# EAGLE design Adafruit Feather 32u4 Adalogger (EAGLE 6.4)
COMPANY: ADAFRUIT INDUSTRIES; DRAWN: KTOWN; REV: B
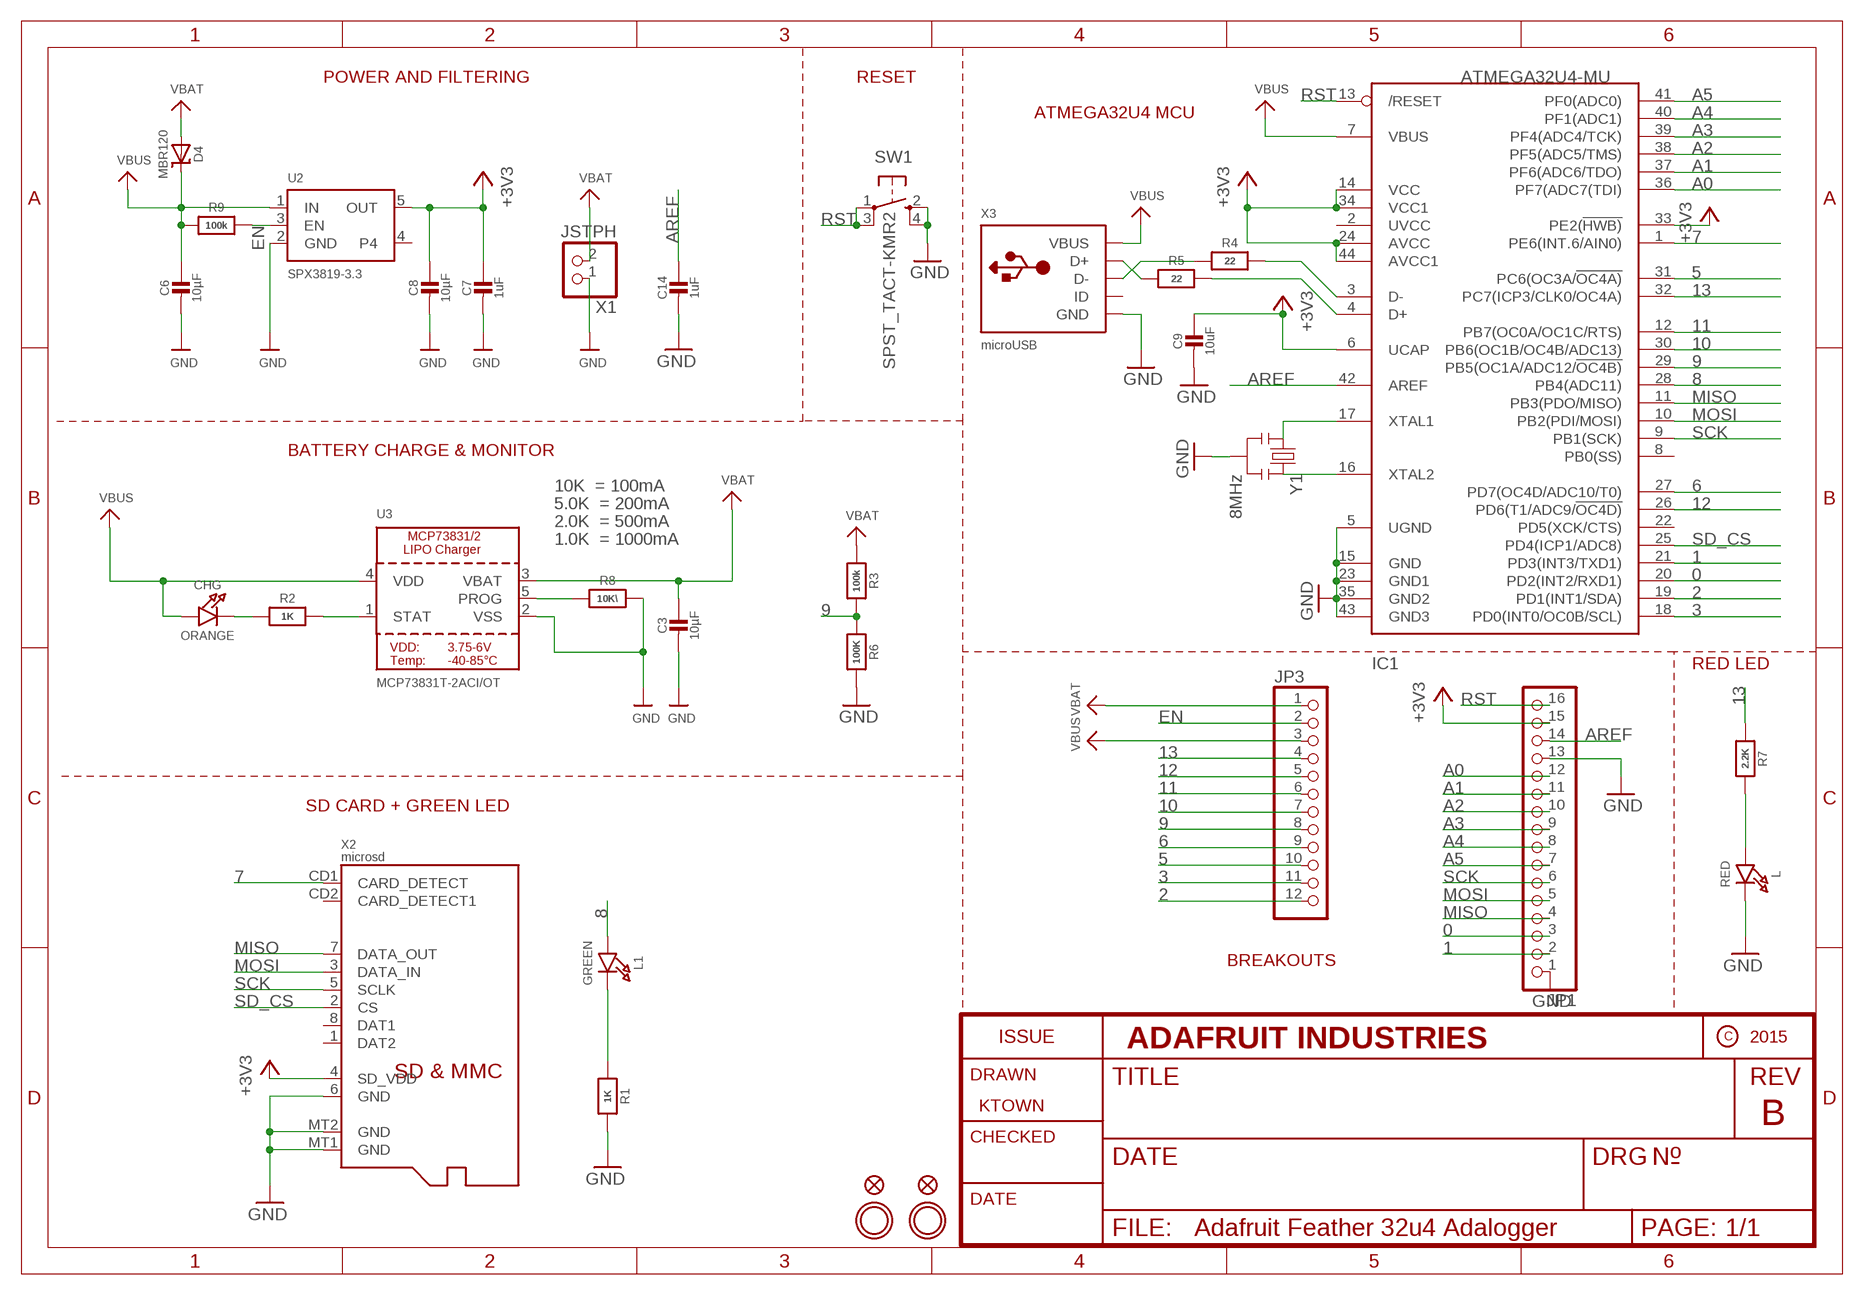
[diagram p0: schematic, sheet 1]

## Parts
C3  10µF  CAP_CERAMIC0805-NOOUTLINE  [0805-NO]
C6  10µF  CAP_CERAMIC0805-NOOUTLINE  [0805-NO]
C7  1uF  CAP_CERAMIC0603_NO  [0603-NO]
C8  10µF  CAP_CERAMIC0805-NOOUTLINE  [0805-NO]
C9  10uF  CAP_CERAMIC0805-NOOUTLINE  [0805-NO]
C14  1uF  CAP_CERAMIC0603_NO  [0603-NO]
CHG  ORANGE  LED0805_NOOUTLINE  [CHIPLED_0805_NOOUTLINE]
D4  MBR120  DIODE-SCHOTTKYSOD-123  [SOD-123]
IC1  ATMEGA32U4-MU  [TQFN44_7MM]
JP1  HEADER-1X16ROUND  [1X16_ROUND]
JP3  HEADER-1X12  [1X12_ROUND]
L  RED  LED0805_NOOUTLINE  [CHIPLED_0805_NOOUTLINE]
L1  GREEN  LED0805_NOOUTLINE  [CHIPLED_0805_NOOUTLINE]
R1  1K  RESISTOR_0603_NOOUT  [0603-NO]
R2  1K  RESISTOR_0603_NOOUT  [0603-NO]
R3  100k  RESISTOR_0603_NOOUT  [0603-NO]
R4  22  RESISTOR_0603_NOOUT  [0603-NO]
R5  22  RESISTOR_0603_NOOUT  [0603-NO]
R6  100K  RESISTOR_0603MP  [_0603MP]
R7  2.2K  RESISTOR_0603_NOOUT  [0603-NO]
R8  10K\  RESISTOR_0603_NOOUT  [0603-NO]
R9  100k  RESISTOR_0603_NOOUT  [0603-NO]
SW1  SPST_TACT-KMR2  [KMR2]
U2  SPX3819-3.3  VREG_SOT23-5  [SOT23-5]
U3  MCP73831T-2ACI/OT  MCP73831/2  [SOT23-5]
U$31  MOUNTINGHOLE2.5  [MOUNTINGHOLE_2.5_PLATED]
U$32  MOUNTINGHOLE2.5  [MOUNTINGHOLE_2.5_PLATED]
U$34  FIDUCIAL""  [FIDUCIAL_1MM]
U$35  FIDUCIAL""  [FIDUCIAL_1MM]
X1  JSTPH  CON_JST_PH_2PIN  [JSTPH2]
X2  microsd  MICROSD  [MICROSD]
X3  microUSB  USB_MICRO_20329_V2  [4UCONN_20329_V2]
Y1  8MHz  RESONATORSMD  [RESONATOR-SMD]

## Nets
0: IC1.20(PD2(INT2/RXD1)) JP1.3
1: IC1.21(PD3(INT3/TXD1)) JP1.2
2: IC1.19(PD1(INT1/SDA)) JP3.12
3: IC1.18(PD0(INT0/OC0B/SCL)) JP3.11
5: IC1.31(PC6(OC3A/!OC4A)) JP3.10
6: IC1.27(PD7(OC4D/ADC10/T0)) JP3.9
7: IC1.1(PE6(INT.6/AIN0)) X2.CD1(CARD_DETECT)
8: IC1.28(PB4(ADC11)) L1.A
9: IC1.29(PB5(OC1A/ADC12/!OC4B)) JP3.8 R3.2 R6.1
10: IC1.30(PB6(OC1B/OC4B/ADC13)) JP3.7
11: IC1.12(PB7(OC0A/OC1C/RTS)) JP3.6
12: IC1.26(PD6(T1/ADC9/!OC4D)) JP3.5
13: IC1.32(PC7(ICP3/CLK0/OC4A)) JP3.4 R7.1
+3V3: C7.1 C8.1 C9.1 IC1.6(UCAP) IC1.14(VCC) IC1.24(AVCC) IC1.33(PE2(!HWB)) IC1.34(VCC1) IC1.44(AVCC1) JP1.15 U2.5(OUT) X2.4(SD_VDD)
A0: IC1.36(PF7(ADC7(TDI)) JP1.12
A1: IC1.37(PF6(ADC6/TDO)) JP1.11
A2: IC1.38(PF5(ADC5/TMS)) JP1.10
A3: IC1.39(PF4(ADC4/TCK)) JP1.9
A4: IC1.40(PF1(ADC1)) JP1.8
A5: IC1.41(PF0(ADC0)) JP1.7
AREF: C14.1 IC1.42(AREF) JP1.14
D+: IC1.4(D+) R5.2
D-: IC1.3(D-) R4.2
EN: JP3.2 R9.2 U2.3(EN)
GND: C3.2 C6.2 C7.2 C8.2 C9.2 C14.2 IC1.5(UGND) IC1.15(GND) IC1.23(GND1) IC1.35(GND2) IC1.43(GND3) JP1.1 JP1.13 L.C R1.2 R6.2 R8.2 SW1.2(S) SW1.4(S1) U2.2(GND) U3.2(VSS) X1.1 X2.6(GND) X2.MT1(GND) X2.MT2(GND) X3.BASE@1(GND) X3.BASE@2(GND) X3.GND X3.SPRT@1(GND) X3.SPRT@2(GND) X3.SPRT@3(GND) X3.SPRT@4(GND) Y1.2
MISO: IC1.11(PB3(PDO/MISO)) JP1.4 X2.7(DATA_OUT)
MOSI: IC1.10(PB2(PDI/MOSI)) JP1.5 X2.3(DATA_IN)
N$1: CHG.C R2.1
N$2: L.A R7.2
N$3: R2.2 U3.1(STAT)
N$4: R8.1 U3.5(PROG)
N$5: L1.C R1.1
N$11: IC1.16(XTAL2) Y1.3
N$12: IC1.17(XTAL1) Y1.1
N$15: R5.1 X3.D+
N$16: R4.1 X3.D-
RST: IC1.13(/RESET) JP1.16 SW1.1(P) SW1.3(P1)
SCK: IC1.9(PB1(SCK)) JP1.6 X2.5(SCLK)
SD_CS: IC1.25(PD4(ICP1/ADC8)) X2.2(CS)
VBAT: C3.1 D4.A JP3.1 R3.1 U3.3(VBAT) X1.2
VBUS: C6.1 CHG.A D4.C IC1.7(VBUS) JP3.3 R9.1 U2.1(IN) U3.4(VDD) X3.VBUS
Unconnected: IC1.2(UVCC) IC1.8(PB0(SS)) IC1.22(PD5(XCK/CTS)) U2.4 X2.1(DAT2) X2.8(DAT1) X2.CD2(CARD_DETECT1) X3.ID

## Notes on the sheet
- POWER AND FILTERING | RESET
- ATMEGA32U4 MCU
- BATTERY CHARGE & MONITOR
- 10K  = 100mA
- 5.0K  = 200mA
- 2.0K  = 500mA
- 1.0K  = 1000mA
- RED LED
- SD CARD + GREEN LED
- BREAKOUTS

## Library data of the parts
C3 C6-C9 C14 = microbuilder:CAP_CERAMIC: Ceramic Capacitors For new designs, use the packages preceded by an '_' character since they are more reliable: The following footprints should be used on most boards: _0402 - Standard footprint for regular board layouts _0603 - Standard footprint for regular board layouts _0805 - Standard footprint for regular board layouts _1206 - Standard footprint for regular board layouts For extremely tight-pitch boards where space is at a premium, the following 'micro-pitch' footprints can be used (smaller pads, no silkscreen outline, etc.): _0402MP - Micro-pitch footprint for very dense/compact boards _0603MP - Micro-pitch footprint for very dense/compact boards _0805MP - Micro-pitch footprint for very dense/compact boards _1206MP - Micro-pitch footprint for very dense/compact boards
CHG L L1 = microbuilder:LED: LED 0603 - 0603 Surface Mount Package 2mA: Green LED - Low Power (3.9mcd, 2ma, 1.7Vf) - Digikey: 475-2709-2-ND Orange LED - Low Power (9.8mcd, 2ma, 1.8Vf) - Digikey: 475-1194-2-ND Red LED - Low Power (5mcd, 2ma, 1.8Vf) - Digikey: 475-1195-2-ND Yellow LED - Low Power (7mcd, 2ma, 1.8Vf) - Digikey: 475-1196-2-ND 5mA: Blue LED - Low Power (17mcd, 5ma, 2.9Vf) - Digikey: LNJ937W8CRACT-ND 0805 - 0805 Surface Mount Package 2mA: Red LED (8.8mcd, 2mA, 1.8Vf, Clear) - Low Power [Digikey: 475-2510-1-ND] Green LED (5mcd, 2mA, 1.8Vf, Clear) - Low Power [Digikey: 475-2730-1-ND] Yellow LED (11.3mcd, 2mA, 1.8Vf, Clear) - Low Power [Digikey: 475-2555-1-ND] 20mA: Red LED (104mcd, 20mA, Diffused) - LS R976 [Digikey: 475-1278-6-ND] Red LED (12mcd, 20mA, 2.0Vf, Clear) - APT2012EC [Digikey: 754-1128-1-ND] Green LED (15mcd, 20mA, 2.2Vf, Clear) - APT2012GC [Digikey: 754-1131-1-ND] Orange LED (160mcd, 20mA, 2.1Vf, Clear) - APT2012SECK [Digikey: 754-1130-1-ND] 1206 - 1206 Surface Mount Package Green LED (26mcd, 20mA, Diffused) - LG N971 [Digikey: 475-1407-6-ND] Red LED (15mcd, 20mA, Diffused) - LH N974 [Digikey: 475-1416-6-ND] Cree - Cree High-Power Surface Mount LEDs XPEBWT-L1-0000-00D50 - White 111lm 350mA 2.9Vf 6200K 110° XTEAWT-00-0000-00000LEE3 - White 114lm 350mA 2.85Vf 5000K 115° Everlight - Everlight 45-21 Series Surface Mount LEDs 45-21/QK2C-B2832AC2CB2/2T - Warm White 2000mcd 20mA 3.25Vf 3050K 120° 45-21/LK2C-B38452C4CB2/2T - Nuetral White 2000mcd 20mA 3.25Vf 4150K 120° 45-21/LK2C-B50634C6CB2/2T - Cold White 2200mcd 20mA 3.25Vf 5650K 120° PLCC2 Reverse Mount LS T77K-J1L2-1-0-2-R18-Z - Red 11.25mcd 2mA 1.8Vf 630nm 120° LO T77K-L1M2-24-Z - Orange 19.6mcd 2mA 1.8Vf 606nm 120° LY T77K-K2M1-26-Z - Yellow 15.7mcd 2mA 1.8Vf 587nm 120°
D4 = microbuilder:DIODE-SCHOTTKY
IC1 = microbuilder:ATMEGA32U4: http://www.ladyada.net/library/eagle
JP1 = microbuilder:HEADER-1X16: PIN HEADER
JP3 = microbuilder:HEADER-1X12
R1-R9 = microbuilder:RESISTOR: Resistors For new designs, use the packages preceded by an '_' character since they are more reliable: The following footprints should be used on most boards: _0402 - Standard footprint for regular board layouts _0603 - Standard footprint for regular board layouts _0805 - Standard footprint for regular board layouts _1206 - Standard footprint for regular board layouts For extremely tight-pitch boards where space is at a premium, the following 'micro-pitch' footprints can be used (smaller pads, no silkscreen outline, etc.): _0402MP - Micro-pitch footprint for very dense/compact boards _0603MP - Micro-pitch footprint for very dense/compact boards _0805MP - Micro-pitch footprint for very dense/compact boards _1206MP - Micro-pitch footprint for very dense/compact boards
SW1 = adafruit:SPST_TACT: SMT 6mm switch, EVQQ2 series http://www.ladyada.net/library/eagle
U2 = microbuilder:VREG_SOT23-5: SOT23-5 Fixed Voltage Regulators Part Current Out V Out V In V Dropout θJA (°C/W) TJ (°C) Digikey Part No. ADP121 150mA 3.3V 3.4-5.5V 0.09V @ 150mA -- -- ADP121-AUJZ33R7CT-ND ADP121 150mA 3.0V 3.1-5.5V 0.09V @ 150mA -- -- ADP121-AUJZ30R7CT-ND ADP122 300mA 3.3V 3.4-5.5V 0.085V @ 300mA -- -- ADP122AUJZ-3.3-R7CT-ND ADP1712 300mA 3.3V 3.5-5.5V 0.17V @ 300mA -- -- ADP1712AUJZ-3.3-R7TR-ND AP7311 (Low Cost) 150mA 3.3V 3.5-6V 0.15V @ 150mA -- -- AP7311-33WG-7DICT-ND LD39015M18R 150mA 1.8V 1.9V-5.5V 0.08V @ 100mA -- -- 497-6977-1-ND LP2985A-33DBVR 150mA 3.3V 3.3-16V 0.28V @ 150mA 206 150 296-18479-1-ND MCP1824T-3302E/OT 300mA 3.3V 3.5V-6V 0.2V @ 300mA -- -- MCP1824T-3302E/OTCT-ND MIC5205-2.5YM5 TR 150mA 2.5V 2.7-16V 0.165V @ 150mA -- -- 576-1257-2-ND MIC5205-3.0YM5 TR 150mA 3.0V 3.2V-16V 0.165V @ 150mA -- -- 576-1258-2-ND MIC5205-3.3YM5 TR 150mA 3.3V 3.5V-16V 0.165V @ 150mA -- -- 576-1259-2-ND TPS780330220 150mA 3.3V+2.2V 3.6-5.5V 250mV Max -- -- 296-23332-1-ND TDA3663/N1,135 100mA 3.3V 3.5-45V 0.18V @ 50mA -- -- 568-5343-1-ND Max operating temp can be calculated using θJA, TJ (max junction temperature), and power in watts. Set the "Maximum Ambient Temperature" until it reaches TJ ("Max Junction Temperature"), which is the absolute limit for safe use of the regulator: Heat Sink Temperature Calculator <http://www.daycounter.com/Calculators/Heat-Sink-Temperature-Calculator.phtml> For example, With 12V source into a 3.3V LP2985 and a 30mA load, we are dissipating (12V-3.3V) * 0.03A = 0.261W. With a θJA of 206 °C/W, a TJ of 150°C, and 261mW we can safely use the chip without a heat sink up to 75°C (=147.1°C Junction Temperature).
U3 = microbuilder:MCP73831/2: MCP73831/2 LIPO Charger VDD: 3.75 - 6V Temp -40 - 85°C Programmable Charge Rate: 15-500mA NOTE: STAT is a tri-state logic output on the MCP73831 and an open-drain output on the MCP73832. SOT23-5 with 4.2V output and tri-state logic on STAT = MCP73831T-2ACI/OT
U$31 U$32 = microbuilder:MOUNTINGHOLE: Mounting Hole For #2 screws (0.086"/2.18mm width, 0.094"/2.4mm hole) use 2.5mm; BOM: EXCLUDE
U$34 U$35 = microbuilder:FIDUCIAL: Fiducial Alignment Points Various fiducial points for machine vision alignment.; BOM: EXCLUDE
X1 = microbuilder:CON_JST_PH_2PIN: JST 2-Pin Right-Angle Connector PH-Series - 4UConnector: 17311 SH-Series - 4UConnector: 07278
X2 = microbuilder:MICROSD: MicroSD/Transflash Card Holder with SPI pinout 3M: 2908-05WB-MG 4UConnector: 19656 Footprint courtesy: Adafruit Industries
X3 = microbuilder:USB: USB Connectors USBMINIB - Surface Mount Female Mini-B USB Connector 4UConnector: 06564
Y1 = SparkFun:RESONATOR: Resonator Small SMD resonator. This is the itty bitty 10/20MHz resonators with built in caps. CSTCE10M0G55 and CSTCE20M0V53. Footprint has been reviewed closely but hasn't been tested yet.

## Board
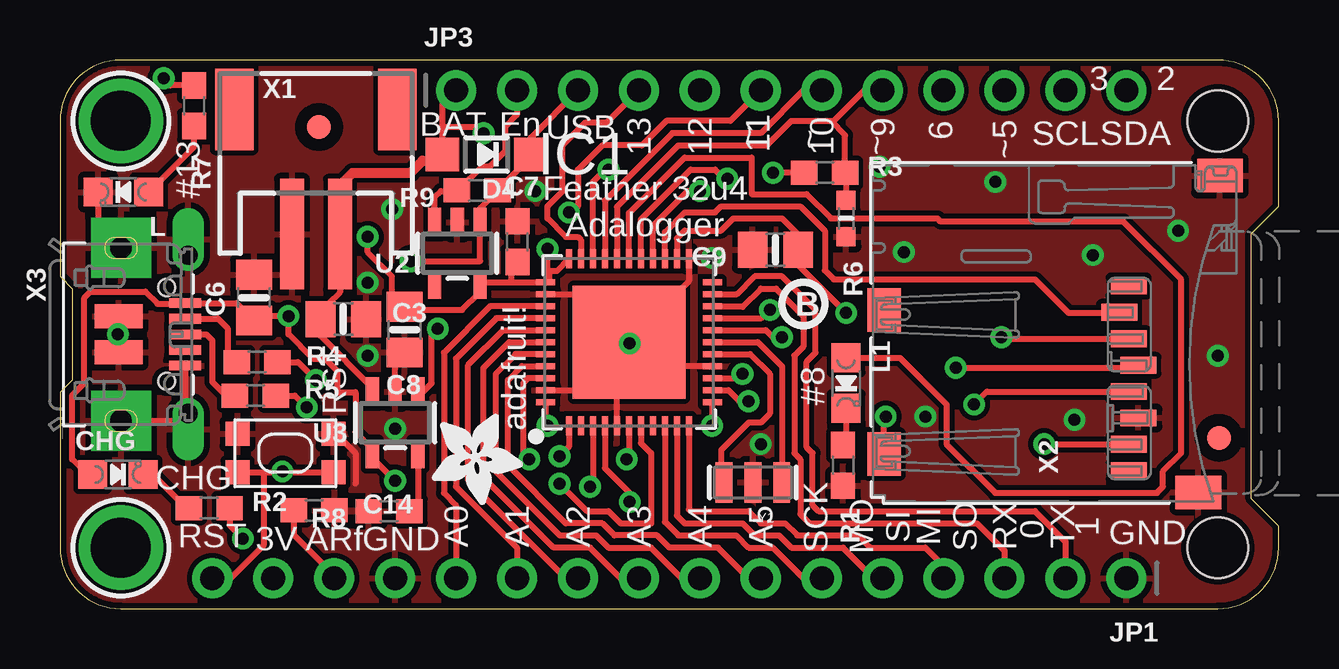
[diagram p1: board, top side]
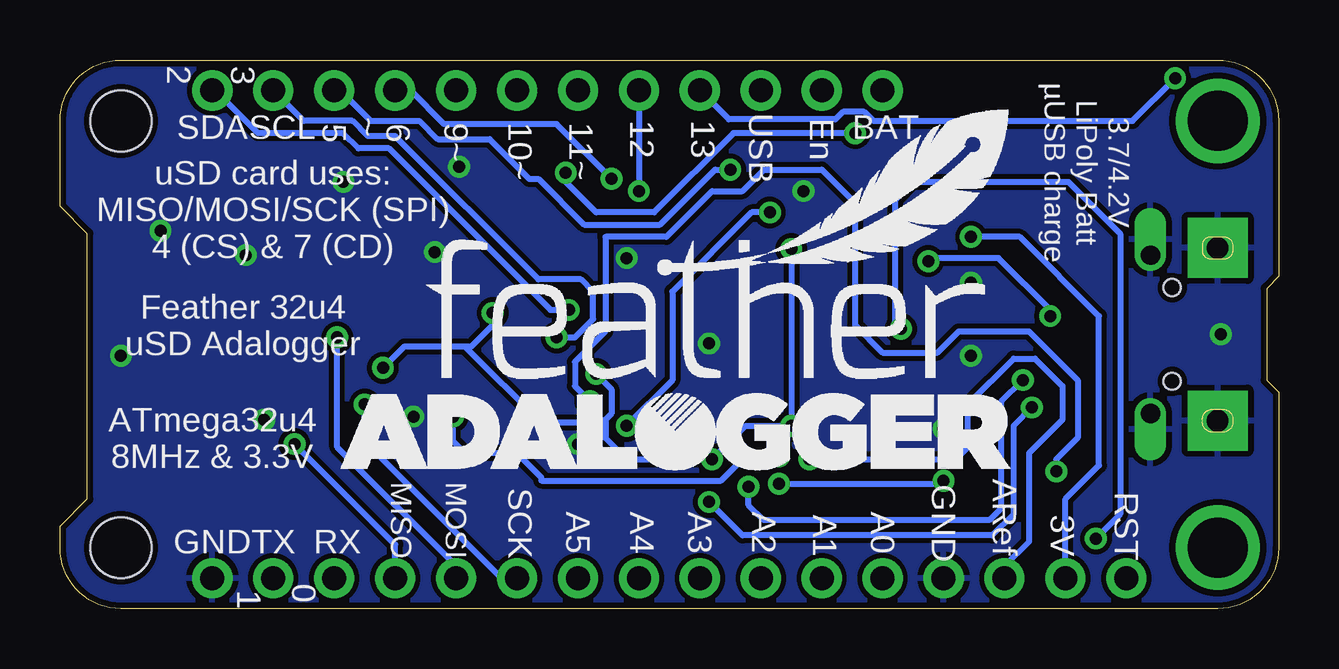
[diagram p2: board, bottom side, seen from below]

Size 50.8 x 22.86 mm. Coordinates in mm from the lower left corner, seen from the top.
Outline: 2.54,0 48.26,0 arc90 50.8,2.54 50.8,3.43 49.66,4.57 49.66,15.62 50.8,16.76 50.8,20.32 arc90 48.26,22.86 2.54,22.86 arc90 0,20.32 0,13.84 0.51,13.34 0.51,9.53 0,9.02 0,2.54 arc90 2.54,0
Copper layers (1*16): Top 0.035mm / dielectric 1.5mm / Bottom 0.035mm
Design rules "adafruit *": minimum track width 8mil, minimum drill 15.5mil, track to track 8mil, track to pad 8mil, pad to pad 8mil, via to via 8mil, smd to smd 8mil, copper to edge 10mil, drill to drill 8mil, minimum pad ring 10mil, minimum via ring 8mil, stop-mask expansion 2mil, vias tented up to drill 20mil, thermal gap 10mil
Holes 2.54 mm at 48.26,20.32 48.26,2.54

### Footprints (pad centres in the part's own frame; a part is rotated, then mirrored left to right if it is on the bottom)
0805-NO = smd 1.24 x 1.5: 1 -0.95,0; 2 0.95,0
0603-NO = smd 1.1 x 1: 1 -0.85,0; 2 0.85,0
CHIPLED_0805_NOOUTLINE = smd 1.2 x 1.2: A 0,-1.05; C 0,1.05
SOD-123 = smd 1.4 x 1.4: A 1.85,0; C -1.85,0
TQFN44_7MM = smd 0.25 x 0.8: 1 -2.5,-3.475; 2 -2,-3.475; 3 -1.5,-3.475; 4 -1,-3.475; 5 -0.5,-3.475; 6 0,-3.475; 7 0.5,-3.475; 8 1,-3.475; 9 1.5,-3.475; 10 2,-3.475; 11 2.5,-3.475; 23 2.5,3.475; 24 2,3.475; 25 1.5,3.475; 26 1,3.475; 27 0.5,3.475; 28 0,3.475; 29 -0.5,3.475; 30 -1,3.475; 31 -1.5,3.475; 32 -2,3.475; 33 -2.5,3.475 | smd 0.8 x 0.25: 12 3.475,-2.5; 13 3.475,-2; 14 3.475,-1.5; 15 3.475,-1; 16 3.475,-0.5; 17 3.475,0; 18 3.475,0.5; 19 3.475,1; 20 3.475,1.5; 21 3.475,2; 22 3.475,2.5; 34 -3.475,2.5; 35 -3.475,2; 36 -3.475,1.5; 37 -3.475,1; 38 -3.475,0.5; 39 -3.475,0; 40 -3.475,-0.5; 41 -3.475,-1; 42 -3.475,-1.5; 43 -3.475,-2; 44 -3.475,-2.5 | smd 4.7 x 4.7: THERMAL 0,0
1X16_ROUND = drill 1 pad 1.676: 1 -19.05,0; 2 -16.51,0; 3 -13.97,0; 4 -11.43,0; 5 -8.89,0; 6 -6.35,0; 7 -3.81,0; 8 -1.27,0; 9 1.27,0; 10 3.81,0; 11 6.35,0; 12 8.89,0; 13 11.43,0; 14 13.97,0; 15 16.51,0; 16 19.05,0
1X12_ROUND = drill 1 pad 1.676: 1 -13.97,0; 2 -11.43,0; 3 -8.89,0; 4 -6.35,0; 5 -3.81,0; 6 -1.27,0; 7 1.27,0; 8 3.81,0; 9 6.35,0; 10 8.89,0; 11 11.43,0; 12 13.97,0
_0603MP = smd 0.8 x 0.8: 1 -0.762,0; 2 0.762,0
KMR2 = smd 1 x 1: 1 2,0.8; 2 2,-0.8; 3 -2,0.8; 4 -2,-0.8
SOT23-5 = smd 0.55 x 1.2: 1 -0.95,-1.3; 2 0,-1.3; 3 0.95,-1.3; 4 0.95,1.3; 5 -0.95,1.3
MOUNTINGHOLE_2.5_PLATED = drill 2.5 pad 3.2: P$1 0,0
FIDUCIAL_1MM = smd 1 x 1: 1 0,0
JSTPH2 = smd 1 x 4.6: 1 -1,-3.7; 2 1,-3.7 | smd 1.6 x 3.4: NC1 -3.4,1.5; NC2 3.4,1.5
MICROSD = smd 0.7 x 1.5: 1 9,-10.64; 2 7.9,-10.24; 3 6.8,-10.64; 4 5.7,-11.04; 5 4.6,-10.64; 6 3.5,-11.04; 7 2.4,-10.64; 8 1.3,-10.64 | smd 1.8 x 1.4: CD1 2,-0.44; CD2 8,-0.44 | smd 1.4 x 1.9: MT1 0.4,-13.54; MT2 13.6,-14.44
4UCONN_20329_V2 = smd 1 x 2: BASE@1 -0.75,-2; BASE@2 0.75,-2 | smd 0.4 x 1.35: D+ 0,0.775; D- -0.65,0.775; GND 1.3,0.775; ID 0.65,0.775; VBUS -1.3,0.775 | drill 0.8 pad 1.2 offset: SPRT@1 -3.3,0.9; SPRT@2 3.3,0.9 | drill 0.9 pad 2.5 square: SPRT@3 -3.6,-1.9; SPRT@4 3.6,-1.9 | hole 0.7: -1.95,0; 1.95,0
RESONATOR-SMD = smd 0.7 x 1.7: 1 -1.2,0; 2 0,0; 3 1.2,0

### Placement (x,y rotation side)
C3  11.81,12.06 0 top
C6  8.09,12.96 90 top
C7  19.07,15.29 90 top
C8  14.37,11.62 270 top
C9  29.82,14.96 180 top
C14  10.59,4.09 0 top
CHG  2.41,5.59 270 top
D4  17.78,18.92 180 top
IC1  23.72,11.1 0 top
JP1  25.4,1.27 180 top
JP3  30.48,21.59 0 top
L  2.65,17.36 90 top
L1  32.77,9.4 180 top
R1  32.64,5.97 270 top
R2  6.22,4.19 0 top
R3  31.88,18.16 0 top
R4  8.22,10.27 0 top
R5  8.15,8.88 0 top
R6  32.77,16.26 270 top
R7  5.59,20.95 270 top
R8  13.72,4.06 180 top
R9  17.4,17.42 180 top
SW1  9.4,6.48 180 top
U2  16.56,14.81 180 top
U3  13.97,7.75 180 top
U$4  [FEATHERLOGO]  35.56,9.53 0 bottom
U$5  [PCBFEAT-REV-040]  30.99,12.7 0 top
U$6  [ADALOGGER_LOGO]  39.12,5.71 0 bottom
U$7  [ADAFRUIT_3.5MM]  15.49,8.13 270 top
U$31  2.54,20.32 270 top
U$32  2.54,2.54 270 top
U$34  10.79,20.07 270 top
U$35  48.31,7.12 270 top
X1  10.67,19.3 0 top
X2  33.91,4.45 90 top
X3  4.45,11.43 270 top
Y1  28.88,5.26 180 top

### Tracks (layer width: path | path; a pad name or v marks a point on that pad's centre or on a via)
0
  Top 0.254: JP1.3 39.37,2.41 38.23,3.56 31.24,3.56 30.86,3.94 30.86,6.22 30.61,6.48 30.61,10.54 30.99,10.92 30.99,12.19 29.84,13.34 29.21,13.34 28.45,12.57 27.22,12.57 IC1.20
1
  Top 0.254: JP1.2 41.91,2.79 40.64,4.06 31.62,4.06 31.37,4.32 31.37,6.48 31.11,6.73 31.11,10.29 31.5,10.67 31.5,12.45 30.1,13.84 28.96,13.84 28.21,13.1 IC1.21
2  (via drill 0.5)
  Top 0.254: IC1.19 29.25,12.1 v29.59,12.45
  Bottom 0.254: 43.94,21.59 JP3.12 44.32,21.59 42.55,19.81 38.99,19.81 38.35,19.18 37.08,19.18 30.35,12.45 v29.59,12.45
3  (via drill 0.5)
  Top 0.254: IC1.18 29.42,11.6 29.72,11.3 v30.1,11.3
  Bottom 0.254: v30.1,11.3 29.34,11.3 28.57,12.06 28.57,13.21 29.08,13.72 30.86,13.72 36.83,19.68 37.97,19.68 38.61,20.32 40.64,20.32 JP3.11
5  (via drill 0.5)
  Top 0.254: IC1.31 22.22,17.78 22.73,18.29 v22.86,18.29
  Bottom 0.254: v22.86,18.29 23.5,18.29 25.78,16 28.96,16 30.86,17.91 31.24,17.91 32.89,19.56 35.05,19.56 35.81,20.32 37.85,20.32 39.12,21.59 JP3.10 39.5,21.59
6  (via drill 0.5)
  Top 0.254: IC1.27 24.22,16.22 26.29,18.29 27.3,18.29 27.69,17.91 v27.81,17.91
  Bottom 0.254: JP3.9 36.2,21.59 34.8,20.19 30.1,20.19 v27.81,17.91
7  (via drill 0.5)
  Top 0.254: IC1.1 21.22,6.74 v20.83,6.35 | X2.CD1 34.35,8 v34.42,8
  Bottom 0.254: v20.83,6.35 21.08,6.1 22.48,6.1 23.24,5.33 30.73,5.33 30.73,5.46 31.75,6.48 33.91,6.48 34.42,6.99 v34.42,8
8
  Top 0.254: IC1.28 23.72,16.48 26.04,18.8 28.83,18.8 28.83,17.27 31.11,17.27 32.13,16.26 36.58,16.26 36.7,16.13 44.32,16.13 46.74,13.72 46.74,6.48 45.97,5.71 45.97,5.08 45.72,4.83 38.99,4.83 36.96,6.86 36.96,8.51 35.02,10.45 L1.A
9
  Top 0.254: IC1.29 23.22,16.74 25.78,19.3 29.46,19.3 30.48,20.32 32.13,20.32 | 32.13,20.32 32.26,20.32 33.53,21.59 JP3.8 | R6.1 32.77,18.12 R3.2 32.73,19.72 32.13,20.32
10
  Top 0.254: JP3.7 30.99,21.59 29.21,19.81 25.53,19.81 22.72,17 IC1.30
11  (via drill 0.5)
  Top 0.254: JP3.6 27.94,20.32 25.27,20.32 24.26,19.3 22.61,19.3 21.59,18.29 21.59,16.76 21.34,16.51 v21.21,16.51 | IC1.12 27.18,8.59 v27.18,7.62
  Bottom 0.254: v21.21,16.51 21.97,16.51 25.27,13.21 25.27,9.53 v27.18,7.62
12  (via drill 0.5)
  Top 0.254: v26.67,17.4 26.16,17.4 24.72,15.96 IC1.26
  Bottom 0.254: JP3.5 v26.67,17.4
13  (via drill 0.5)
  Top 0.254: JP3.4 22.8,20.26 21.91,20.26 20.95,19.3 20.95,17.4 20.32,16.76 20.32,16.26 21.08,15.49 21.59,15.49 21.72,15.37 IC1.32 | R7.1 4.61,21.8 v4.32,22.1
  Bottom 0.254: JP3.4 22.92,20.38 18.48,20.38 18.16,20.7 17.27,20.7 16.89,20.32 6.1,20.32 v4.32,22.1
+3V3  (via drill 0.5)
  Top 0.254: IC1.33 20.71,14.07 20.39,14.07 | 20.39,14.07 20.32,14.14 v20.32,14.99 | IC1.14 28.27,9.6 v28.45,9.78 | IC1.24 25.72,15.43 26.04,15.75 27.56,15.75 28.07,16.26 30.1,16.26 30.77,15.58 C9.1 30.77,14.31 v32.77,12.32 | 18.8,13.6 17.6,13.6 U2.5 17.46,13.46 17.46,13.14 16.76,12.45 14.49,12.45 C8.1 13.84,13.1 13.84,13.84 12.83,14.86 v12.83,15.49 | 18.8,13.6 IC1.34 20.39,13.6 20.39,14.07 | v37.34,10.03 44.95,10.03 X2.4 | C7.1 18.8,14.17 18.8,13.6 | IC1.44 20.24,7.7 v20.32,7.62 | IC1.6 23.72,6.32 v23.62,6.22
  Bottom 0.254: v20.32,14.99 v20.32,7.62 22.23,7.62 v23.62,6.22 27.18,6.22 28.07,7.11 | v28.45,9.78 27.81,9.14 27.81,8.13 28.07,7.87 28.07,7.11 | 28.07,7.11 28.7,7.75 30.73,7.75 33.91,10.92 | JP1.15 8.89,4.57 7.49,5.97 7.49,12.19 10.79,15.49 v12.83,15.49 | 33.91,10.92 33.66,10.92 32.77,11.81 v32.77,12.32 | v37.34,10.03 36.45,10.92 33.91,10.92
A0
  Top 0.254: IC1.36 17.94,12.6 16,10.67 16,4.83 16.51,4.32 JP1.12
A1
  Top 0.254: IC1.37 18.2,12.1 16.51,10.41 16.51,5.08 19.05,2.54 JP1.11
A2
  Top 0.254: JP1.10 21.08,1.27 17.02,5.33 17.02,10.16 18.46,11.6 IC1.38
A3
  Top 0.254: JP1.9 23.37,1.27 22.1,2.54 20.57,2.54 17.65,5.46 17.65,10.03 18.72,11.1 IC1.39
A4
  Top 0.254: IC1.40 18.98,10.6 18.16,9.78 18.16,5.71 20.83,3.05 22.35,3.05 22.86,2.54 24.64,2.54 25.91,1.27 JP1.8
A5
  Top 0.254: JP1.7 28.7,1.27 27.43,2.54 25.4,2.54 24.89,3.05 23.11,3.05 22.61,3.56 21.08,3.56 18.67,5.97 18.67,9.53 19.25,10.1 IC1.41
AREF  (via drill 0.5)
  Top 0.254: IC1.42 19.51,9.6 19.3,9.4 19.3,6.48 v19.56,6.22 | C14.1 9.74,3.08 11.43,1.4 JP1.14
  Bottom 0.254: v19.56,6.22 13.46,6.22 12.95,6.73 12.95,8.51 11.05,10.41 10.16,10.41 9.02,9.27 9.02,7.87 10.41,6.48 10.41,2.79 11.43,1.78 JP1.14
D+  (via drill 0.5)
  Top 0.254: IC1.4 22.72,5.86 23.75,4.83 v23.75,4.45 | R5.2 9.79,8.88 v10.29,8.38
  Bottom 0.254: v23.75,4.45 22.35,3.05 11.94,3.05 11.05,3.94 11.05,7.62 v10.29,8.38
D-  (via drill 0.5)
  Top 0.254: IC1.3 22.22,5.2 v22.1,5.08 | R4.2 9.93,10.27 v10.67,9.53
  Bottom 0.254: v22.1,5.08 22.1,4.32 21.46,3.68 12.06,3.68 11.56,4.19 11.56,8.64 v10.67,9.53
EN
  Top 0.254: JP3.2 19.05,20.57 18.54,20.07 18.54,19.05 17.91,18.41 17.57,18.41 16.57,17.42 R9.2 16.52,17.4 15.88,17.4 15.61,17.14 U2.3
GND  (via drill 0.5)
  Top 0.254: IC1.15 25.08,10.1 23.88,11.3 | IC1.5 23.22,10.52 v23.75,11.05 | IC1.43 22.31,9.1 23.75,10.54 v23.75,11.05 | IC1.35 22.08,13.1 23.88,11.3 | IC1.23 26.22,13.64 23.88,11.3 | L.C 1.59,15.03 X3.SPRT@3 | X3.GND 5.22,8.26 X3.SPRT@2 5.04,7.83 X3.SPRT@4 | 23.88,11.3 23.88,11.18 v23.75,11.05 | U3.2 13.97,10.67 C8.2 | SW1.4 11.52,7.28 12.32,6.48 12.32,5.21
  other vias: 38.99,17.78 29.21,6.86 36.07,8 2.41,11.43 12.83,13.59 27.18,14.61 34.16,18.41 19.81,17.4 12.83,10.54 13.97,7.49 35.18,14.86 42.29,7.87 48.26,10.54 46.61,15.75 43.05,14.73 13.84,16.64
  pour Top: -0.25,23.24 -0.25,-0.25 51.18,0 51.18,22.86
  pour Bottom: -0.13,0.25 51.18,0 51.18,22.86 -0.25,23.11
MISO  (via drill 0.5)
  Top 0.254: JP1.4 36.83,1.78 36.07,2.54 33.78,2.54 33.27,3.05 30.73,3.05 30.23,3.56 29.21,3.56 28.7,4.06 26.29,4.06 26.22,4.13 IC1.11 | v41.02,6.86 44.54,6.86 X2.7
  Bottom 0.254: JP1.4 36.83,2.67 v41.02,6.86
MOSI  (via drill 0.5)
  Top 0.254: JP1.5 33.91,1.27 32.64,2.54 30.48,2.54 29.97,3.05 28.96,3.05 28.45,3.56 26.04,3.56 25.72,3.87 IC1.10 | X2.3 39.44,11.24 39.38,11.3 v39.24,11.3
  Bottom 0.254: JP1.5 34.29,1.78 39.24,6.73 v39.24,11.3
N$1
  Top 0.254: CHG.C 3.88,5.59 5.27,4.19 R2.1
N$2
  Top 0.254: L.A 5.59,19.25 R7.2
N$3  (via drill 0.5)
  Top 0.254: U3.1 15.14,9.05 15.49,9.4 15.49,11.4 v15.75,11.66 | R2.2 7.07,3.47 v7.62,2.92
  Bottom 0.254: v15.75,11.66 16,11.91 16,17.02 15.24,17.78 8.76,17.78 6.6,15.62 6.6,3.94 v7.62,2.92
N$4
  Top 0.254: U3.5 14.92,4.42 R8.1
N$5
  Top 0.254: L1.C 32.77,6.82 R1.1
N$11
  Top 0.254: IC1.16 28.77,10.6 29.59,9.78 29.59,8.13 29.21,7.75 28.7,7.75 27.56,6.6 27.56,5.38 Y1.3
N$12
  Top 0.254: IC1.17 29.09,11.1 30.1,10.09 30.1,5.26 Y1.1
N$15
  Top 0.254: X3.D+ 6.1,11.43 6.35,11.18 6.35,9.45 6.92,8.88 R5.1
N$16
  Top 0.254: X3.D- 6.59,12.08 6.99,11.68 6.99,10.65 R4.1
RST  (via drill 0.5)
  Top 0.254: IC1.13 27.86,9.1 28.32,8.64 v28.7,8.64 | SW1.1 8.51,5.68 | 6.48,1.27 JP1.16 7.11,1.27 8.51,2.67 8.51,5.68 | 8.51,5.68 9.27,5.68 | 9.27,5.68 v9.27,5.71 | 9.27,5.68 SW1.3
  Bottom 0.254: v9.27,5.71 9.27,6.22 8.38,7.11 8.38,9.53 10.41,11.56 13.34,11.56 14.22,10.67 16.51,10.67 17.65,11.81 17.65,16.89 19.05,18.29 21.46,18.29 22.35,17.4 23.62,17.4 25.53,15.49 28.07,15.49 28.07,11.56 29.34,10.29 29.34,9.27 v28.7,8.64
SCK  (via drill 0.5)
  Top 0.254: IC1.9 25.22,3.61 25.78,3.05 28.19,3.05 28.7,2.54 29.72,2.54 30.99,1.27 JP1.6 | v38.1,8.51 38.64,9.04 X2.5
  Bottom 0.254: JP1.6 31.62,1.4 32.51,1.4 38.1,6.99 v38.1,8.51
SD_CS
  Top 0.254: IC1.25 25.22,15.69 26.04,16.51 27.3,16.51 27.56,16.76 30.86,16.76 31.88,15.75 31.88,14.1 32.26,13.72 40.64,13.72 42.04,12.32 44.15,12.32 X2.2
VBAT  (via drill 0.5)
  Top 0.254: U3.3 13.02,9.21 10.86,11.36 C3.1 11.18,12.38 11.18,12.7 11.67,13.19 X1.2 | JP3.1 15.93,21.01 15.93,20.07 | 15.93,20.07 D4.A | v17.65,19.81 17.4,20.07 15.93,20.07 | R3.1 v29.72,18.16
  Top 0.406: X1.2 11.67,17.64 12.19,18.16 14.61,18.16 15.11,18.67 15.68,18.67 D4.A
  Bottom 0.254: v17.65,19.81 22.73,19.81 26.04,16.51 28.45,16.51 29.72,17.78 v29.72,18.16
VBUS  (via drill 0.5)
  Top 0.254: IC1.7 24.22,6.9 24.64,6.48 24.64,3.56 23.37,3.56 22.86,4.06 21.97,4.06 v20.83,5.21 | JP3.3 19.63,19.63 D4.C 19.75,18.92 R9.1 17.51,16.69 U2.1 17.51,14.48 v14.61,14.48 | CHG.A 1.14,5.59 0.51,6.22 0.51,8.89 1.02,9.4 1.02,12.95 1.27,13.21 3.56,13.21 4.06,12.7 5.19,12.7 X3.VBUS 7.37,12.73 C6.1 8.27,12.19 v9.53,12.19 9.53,11.43 10.54,10.41 11.05,10.41 11.56,9.91 11.56,9.02 12.32,9.02 12.32,7.37 13.02,6.67 U3.4 13.02,6.28 v13.97,5.33
  Bottom 0.254: v14.61,14.48 14.48,14.61 11.68,14.61 9.53,12.45 v9.53,12.19 | v20.83,5.21 14.1,5.21 v13.97,5.33

### Text on the board
tPlace: 3 | 2 | BAT | En | USB | 13 | 12 | ~ | 11 | ~ | 10 | 9 | 6 | ~5 | SCL | SDA | ~ | #13 | Feather 32u4 / Adalogger | RST | adafruit! | #8 | CHG | SCK | RST | 3V | ARf | GND | A0 | A1 | A2 | A3 | A4 | A5 | MO / SI | MI / SO | RX | 0 | TX | 1 | GND
bPlace: 3 | 2 | BAT | En | 13 | 12 | 6 | ~ | 5 | SCL | SDA | USB | 11~ | 10~ | 9~ | 3.7/4.2V / LiPoly Batt / µUSB charge | uSD card uses: / MISO/MOSI/SCK (SPI) / 4 (CS) & 7 (CD) | Feather 32u4 / uSD Adalogger | ATmega32u4 / 8MHz & 3.3V | ARef | GND | SCK | MOSI | MISO | RST | 3V | A0 | A1 | A2 | A3 | A4 | A5 | RX | TX | GND | 0 | 1